# Altium project 自平衡小车主控板.PrjPcb
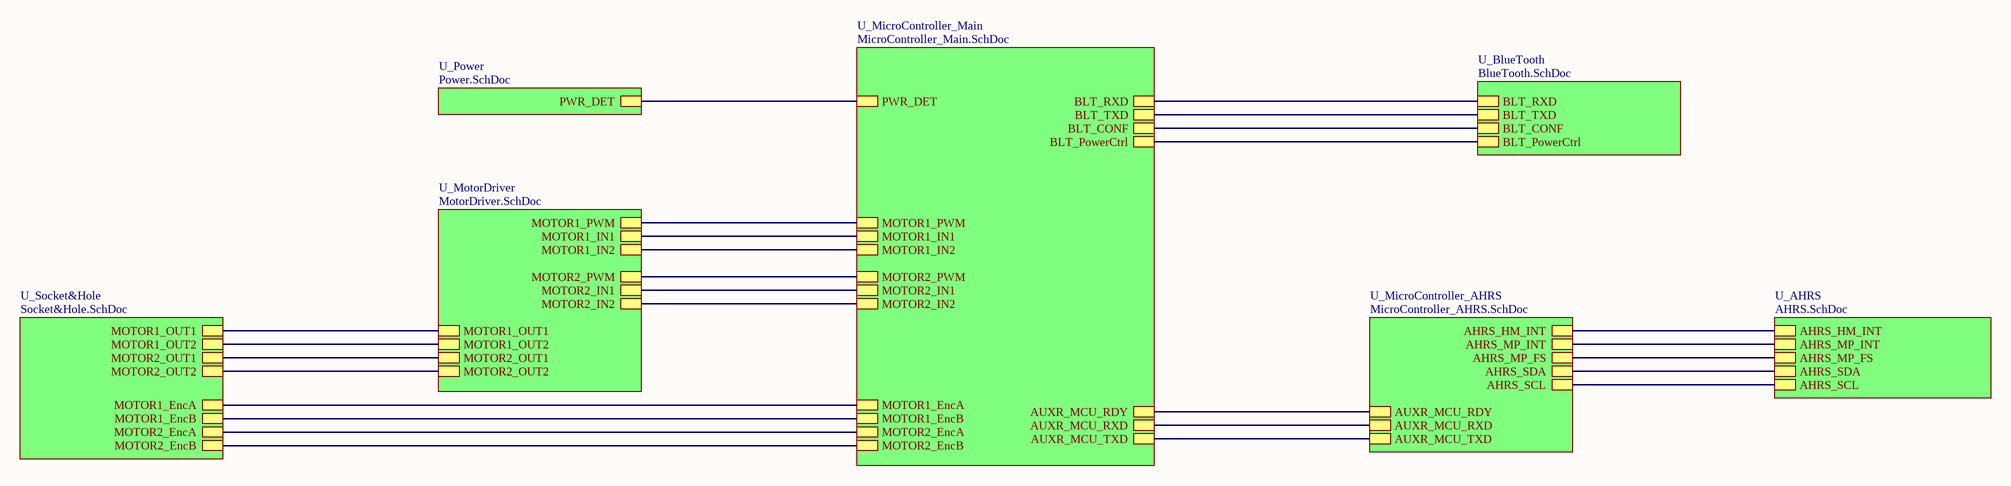
[diagram p0: FrameWork.SchDoc]
8 sheets, 113 parts. Net scope: hierarchical (ports join the sheet entries above them; power ports are global).
Board file: 自平衡小车主控板.PcbDoc
Sheets:
  FrameWork.SchDoc
    U_MicroController_Main = MicroController_Main.SchDoc
    U_Socket&Hole = Socket&Hole.SchDoc
    U_MotorDriver = MotorDriver.SchDoc
    U_MicroController_AHRS = MicroController_AHRS.SchDoc
    U_AHRS = AHRS.SchDoc
    U_Power = Power.SchDoc
    U_BlueTooth = BlueTooth.SchDoc

## Sheet FrameWork.SchDoc: FrameWork.SchDoc
size A3; Author: flotox@yeah.net; Revision: v1.0.0; SheetNumber: 1; SheetTotal: 10

### Sub-sheets
U_AHRS = AHRS.SchDoc: AHRS_MP_INT, AHRS_SCL, AHRS_SDA, AHRS_MP_FS, AHRS_HM_INT
U_BlueTooth = BlueTooth.SchDoc: BLT_RXD, BLT_TXD, BLT_CONF, BLT_PowerCtrl
U_MicroController_AHRS = MicroController_AHRS.SchDoc: AUXR_MCU_RDY, AUXR_MCU_TXD, AUXR_MCU_RXD, AHRS_SCL, AHRS_SDA, AHRS_HM_INT, AHRS_MP_INT, AHRS_MP_FS
U_MicroController_Main = MicroController_Main.SchDoc: BLT_RXD, BLT_TXD, BLT_CONF, BLT_PowerCtrl, AUXR_MCU_TXD, AUXR_MCU_RXD, AUXR_MCU_RDY, PWR_DET, MOTOR1_PWM, MOTOR1_IN2, MOTOR1_IN1, MOTOR2_IN1, MOTOR2_IN2, MOTOR2_PWM, MOTOR1_EncA, MOTOR1_EncB, MOTOR2_EncA, MOTOR2_EncB
U_MotorDriver = MotorDriver.SchDoc: MOTOR1_OUT1, MOTOR1_OUT2, MOTOR2_OUT1, MOTOR2_OUT2, MOTOR1_PWM, MOTOR2_PWM, MOTOR1_IN1, MOTOR1_IN2, MOTOR2_IN1, MOTOR2_IN2
U_Power = Power.SchDoc: PWR_DET
U_Socket&Hole = Socket&Hole.SchDoc: MOTOR1_EncA, MOTOR1_EncB, MOTOR2_EncA, MOTOR2_EncB, MOTOR1_OUT1, MOTOR1_OUT2, MOTOR2_OUT1, MOTOR2_OUT2

### Nets
Adc12_In5: sheet U_MicroController_Main/PWR_DET, sheet U_Power/PWR_DET
I2C1_Scl': sheet U_MicroController_AHRS/AHRS_SCL, sheet U_AHRS/AHRS_SCL
I2C1_Sda': sheet U_MicroController_AHRS/AHRS_SDA, sheet U_AHRS/AHRS_SDA
Tim1Ch1: sheet U_MicroController_Main/MOTOR1_IN1, sheet U_MotorDriver/MOTOR1_IN1
Tim1Ch1N: sheet U_MicroController_Main/MOTOR1_IN2, sheet U_MotorDriver/MOTOR1_IN2
Tim1Ch2: sheet U_MicroController_Main/MOTOR1_PWM, sheet U_MotorDriver/MOTOR1_PWM
Tim2Ch1: sheet U_MicroController_Main/MOTOR2_EncA, sheet U_Socket&Hole/MOTOR2_EncA
Tim2Ch2: sheet U_MicroController_Main/MOTOR2_EncB, sheet U_Socket&Hole/MOTOR2_EncB
Tim3Ch1: sheet U_MicroController_Main/MOTOR1_EncA, sheet U_Socket&Hole/MOTOR1_EncA
Tim3Ch2: sheet U_MicroController_Main/MOTOR1_EncB, sheet U_Socket&Hole/MOTOR1_EncB
Tim8Ch1: sheet U_MicroController_Main/MOTOR2_IN1, sheet U_MotorDriver/MOTOR2_IN1
Tim8Ch1N: sheet U_MicroController_Main/MOTOR2_IN2, sheet U_MotorDriver/MOTOR2_IN2
Tim8Ch2: sheet U_MicroController_Main/MOTOR2_PWM, sheet U_MotorDriver/MOTOR2_PWM
Usart2_Rx: sheet U_MicroController_Main/AUXR_MCU_RXD, sheet U_MicroController_AHRS/AUXR_MCU_RXD
Usart2_Rx': sheet U_MicroController_Main/AUXR_MCU_TXD, sheet U_MicroController_AHRS/AUXR_MCU_TXD
Usart5_Rx: sheet U_MicroController_Main/BLT_RXD, sheet U_BlueTooth/BLT_RXD
Usart5_Tx: sheet U_MicroController_Main/BLT_TXD, sheet U_BlueTooth/BLT_TXD
NetJP7_5: sheet U_Socket&Hole/MOTOR1_OUT1, sheet U_MotorDriver/MOTOR1_OUT1
NetJP7_6: sheet U_Socket&Hole/MOTOR1_OUT2, sheet U_MotorDriver/MOTOR1_OUT2
NetJP8_5: sheet U_Socket&Hole/MOTOR2_OUT1, sheet U_MotorDriver/MOTOR2_OUT1
NetJP8_6: sheet U_Socket&Hole/MOTOR2_OUT2, sheet U_MotorDriver/MOTOR2_OUT2
NetR3_1: sheet U_MicroController_Main/BLT_CONF, sheet U_BlueTooth/BLT_CONF
NetR6_2: sheet U_MicroController_Main/BLT_PowerCtrl, sheet U_BlueTooth/BLT_PowerCtrl
NetU1_15: sheet U_MicroController_AHRS/AHRS_HM_INT, sheet U_AHRS/AHRS_HM_INT
NetU2_11: sheet U_MicroController_AHRS/AHRS_MP_FS, sheet U_AHRS/AHRS_MP_FS
NetU2_12: sheet U_MicroController_AHRS/AHRS_MP_INT, sheet U_AHRS/AHRS_MP_INT
NetU4_11: sheet U_MicroController_Main/AUXR_MCU_RDY, sheet U_MicroController_AHRS/AUXR_MCU_RDY

### Notes on the sheet
- Title
- Revision:
- Number:
- Author:
- Check By:
- Sheet
- of
- Size:
- A3
- Date:

## Sheet MicroController_Main.SchDoc: MicroController_Main.SchDoc
size A4; Author: flotox@yeah.net; Revision: v1.0.0; SheetNumber: 7; SheetTotal: 10
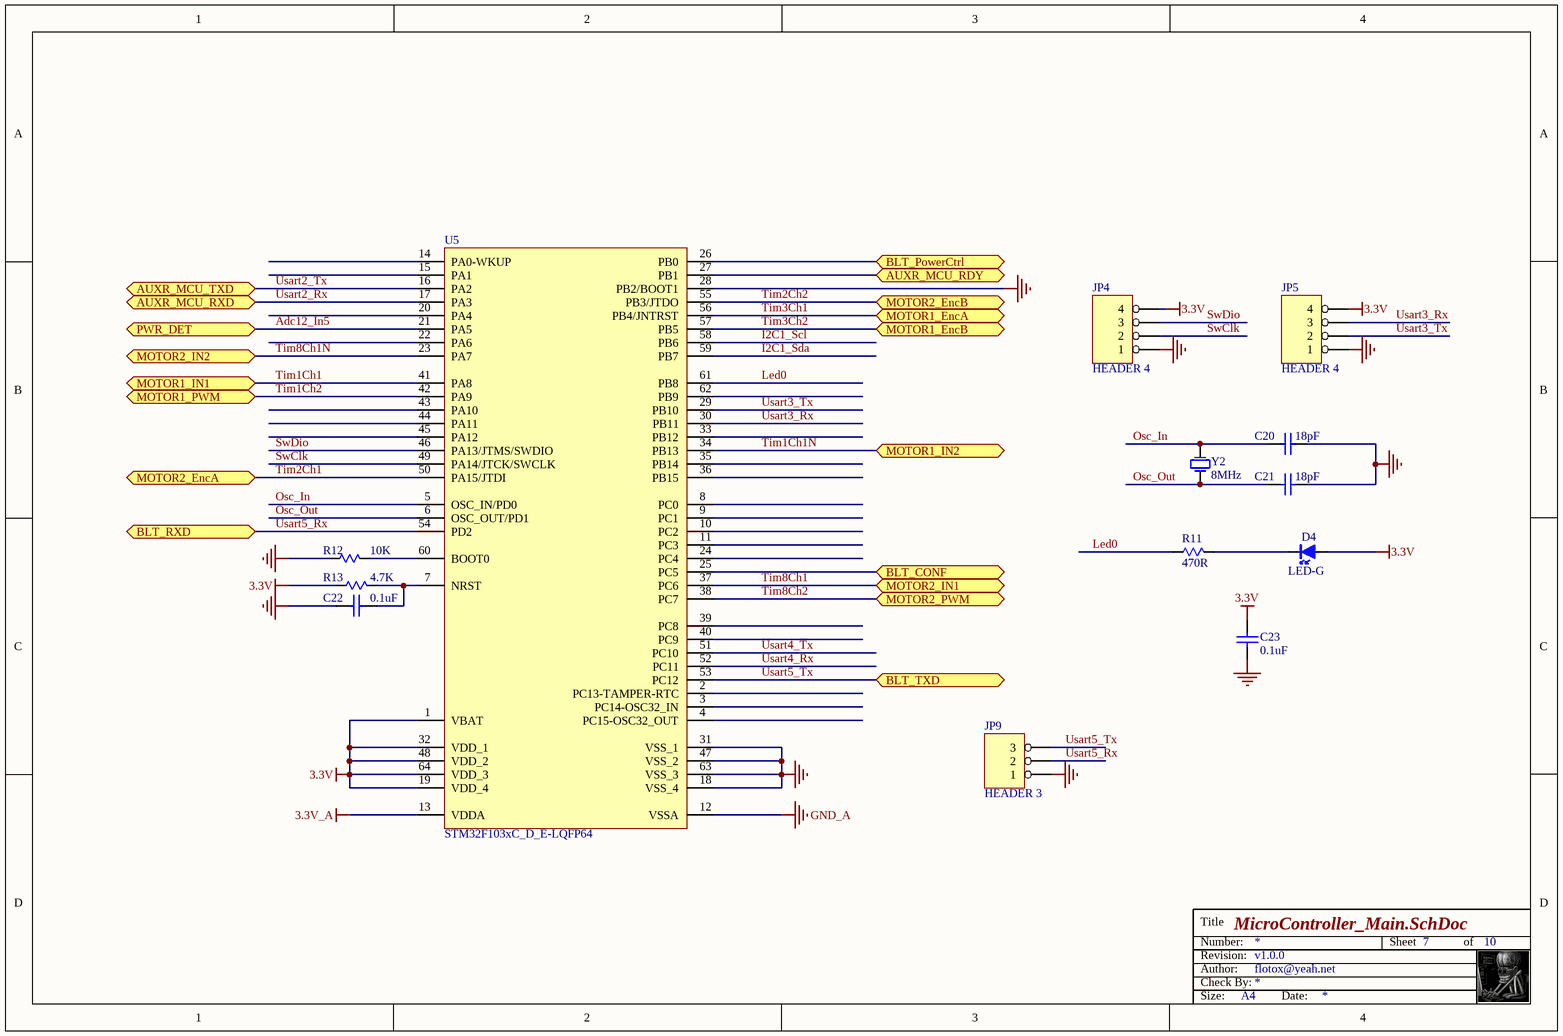
[diagram p1: MicroController_Main.SchDoc]

### Parts
C20  18pF  [C0603-S]
C21  18pF  [C0603-S]
C22  0.1uF  [C0603-S]
C23  0.1uF  [C0603-S]
D4  LED-G  [LED0603]
JP4  HEADER 4  [HDR1X4]
JP5  HEADER 4  [SPOX-4P]
JP9  HEADER 3  [HDR1X3]
R11  470R  [R0603-S]
R12  10K  [R0603-S]
R13  4.7K  [R0603-S]
U5  STM32F103xC_D_E-LQFP64  [LQFP10X10-64]
Y2  8MHz  [XTAL-49SMD]

### Ports
AUXR_MCU_RDY, AUXR_MCU_RXD, AUXR_MCU_TXD, BLT_CONF, BLT_PowerCtrl, BLT_RXD, BLT_TXD, MOTOR1_EncA, MOTOR1_EncB, MOTOR1_IN1, MOTOR1_IN2, MOTOR1_PWM, MOTOR2_EncA, MOTOR2_EncB, MOTOR2_IN1, MOTOR2_IN2, MOTOR2_PWM, PWR_DET

### Nets
3.3V: C23.2 D4.1(A) JP4.4 JP5.4 R13.2 U5.1(VBAT) U5.19(VDD_4) U5.32(VDD_1) U5.48(VDD_2) U5.64(VDD_3)
3.3V_A: U5.13(VDDA)
GND: C20.1 C21.1 C22.2 C23.1 JP4.1 JP5.1 JP9.1 R12.2 U5.18(VSS_4) U5.28(PB2/BOOT1) U5.31(VSS_1) U5.47(VSS_2) U5.63(VSS_3)
GND_A: U5.12(VSSA)
Adc12_In5: U5.21(PA5) ; port PWR_DET
I2C1_Scl: U5.58(PB6)
I2C1_Sda: U5.59(PB7)
Led0: R11.2 U5.61(PB8)
Osc_In: C20.2 U5.5(OSC_IN/PD0) Y2.1(OSC1)
Osc_Out: C21.2 U5.6(OSC_OUT/PD1) Y2.2(OSC2)
SwClk: JP4.2 U5.49(PA14/JTCK/SWCLK)
SwDio: JP4.3 U5.46(PA13/JTMS/SWDIO)
Tim1Ch1: U5.41(PA8) ; port MOTOR1_IN1
Tim1Ch1N: U5.34(PB13) ; port MOTOR1_IN2
Tim1Ch2: U5.42(PA9) ; port MOTOR1_PWM
Tim2Ch1: U5.50(PA15/JTDI) ; port MOTOR2_EncA
Tim2Ch2: U5.55(PB3/JTDO) ; port MOTOR2_EncB
Tim3Ch1: U5.56(PB4/JNTRST) ; port MOTOR1_EncA
Tim3Ch2: U5.57(PB5) ; port MOTOR1_EncB
Tim8Ch1: U5.37(PC6) ; port MOTOR2_IN1
Tim8Ch1N: U5.23(PA7) ; port MOTOR2_IN2
Tim8Ch2: U5.38(PC7) ; port MOTOR2_PWM
Usart2_Rx: U5.17(PA3) ; port AUXR_MCU_RXD
Usart2_Tx: U5.16(PA2) ; port AUXR_MCU_TXD  [project net Usart2_Rx']
Usart3_Rx: JP5.3 U5.30(PB11)
Usart3_Tx: JP5.2 U5.29(PB10)
Usart4_Rx: U5.52(PC11)
Usart4_Tx: U5.51(PC10)
Usart5_Rx: JP9.2 U5.54(PD2) ; port BLT_RXD
Usart5_Tx: JP9.3 U5.53(PC12) ; port BLT_TXD
NetC22_1: C22.1 R13.1 U5.7(NRST)
NetD4_2: D4.2(K) R11.1
NetR3_1: U5.25(PC5) ; port BLT_CONF
NetR6_2: U5.26(PB0) ; port BLT_PowerCtrl
NetR12_1: R12.1 U5.60(BOOT0)
NetU4_11: U5.27(PB1) ; port AUXR_MCU_RDY

Not connected (* = marked no-connect by the designer): U5 2(PC13-TAMPER-RTC) 3(PC14-OSC32_IN) 4(PC15-OSC32_OUT) 8(PC0) 9(PC1) 10(PC2) 11(PC3) 14(PA0-WKUP) 15(PA1) 20(PA4) 22(PA6) 24(PC4) 33(PB12) 35(PB14) 36(PB15) 39(PC8) 40(PC9) 43(PA10) 44(PA11) 45(PA12) 62(PB9)

### Notes on the sheet
- Title
- Revision:
- Number:
- Author:
- Check By:
- Sheet
- of
- Size:
- A4
- Date:

### Library data of the parts
C20-C23 = CAP: Capacitor
D4 = LED: Light Emitting Diode
R11-R13 = RES: Resistor
U5 = STM32F103xC_D_E-LQFP64: High-density performance line ARM-based 32-bit MCU with 256 to 512KB Flash, USB, CAN, 11 timers, 3 ADCs, 13 communication interfaces
Y2 = XTAL-CRYSTALS: Crystals

## Sheet Socket&Hole.SchDoc: Socket&Hole.SchDoc
size A4; CheckedBy: fx; Author: flotox@yeah.net; Revision: v1.0.0; SheetNumber: 10; SheetTotal: 10
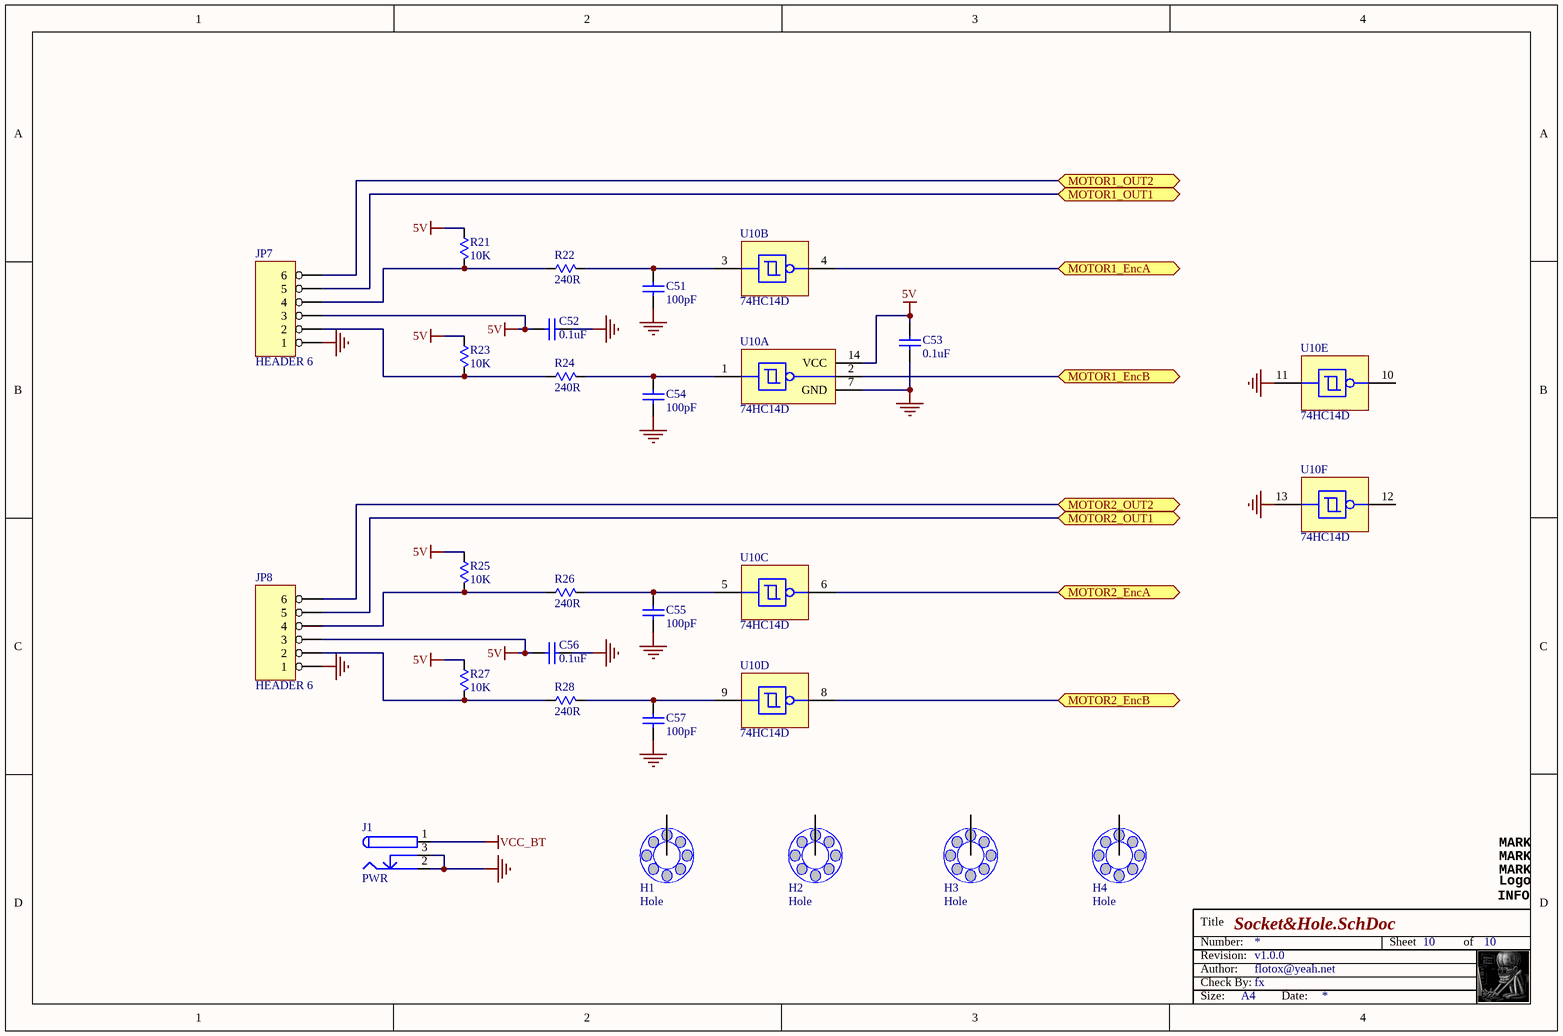
[diagram p2: Socket&Hole.SchDoc]

### Parts
C51  100pF  [C0603-S]
C52  0.1uF  [C0603-S]
C53  0.1uF  [C0603-S]
C54  100pF  [C0603-S]
C55  100pF  [C0603-S]
C56  0.1uF  [C0603-S]
C57  100pF  [C0603-S]
H1  Hole  [HT-M3-S]
H2  Hole  [HT-M3-S]
H3  Hole  [HT-M3-S]
H4  Hole  [HT-M3-S]
INFO1  INFO  [FX_DESIGN_INFO]  (value not drawn)
J1  PWR  [POWER-A]
JP7  HEADER 6  [WHDR2.0X6]
JP8  HEADER 6  [WHDR2.0X6]
LG1  LOGO  [Hat_Logo]  (value not drawn)
MARK1  MARK  [MARK-S]  (value not drawn)
MARK2  MARK  [MARK-S]  (value not drawn)
MARK3  MARK  [MARK-S]  (value not drawn)
R21  10K  [R0603-S]
R22  240R  [R0603-S]
R23  10K  [R0603-S]
R24  240R  [R0603-S]
R25  10K  [R0603-S]
R26  240R  [R0603-S]
R27  10K  [R0603-S]
R28  240R  [R0603-S]
U10  74HC14D  [SO14-150]  (parts A,B,C,D,E,F of 6)

### Ports
MOTOR1_EncA, MOTOR1_EncB, MOTOR1_OUT1, MOTOR1_OUT2, MOTOR2_EncA, MOTOR2_EncB, MOTOR2_OUT1, MOTOR2_OUT2

### Nets
5V: C52.1 C53.1 C56.1 JP7.3 JP8.3 R21.2 R23.2 R25.2 R27.2 U10.14(VCC)
GND: C51.1 C52.2 C53.2 C54.1 C55.1 C56.2 C57.1 J1.2 J1.3 JP7.1 JP8.1 U10.7(GND) U10.11(A) U10.13(A)
VCC_BT: J1.1
Tim2Ch1: U10.6(Y) ; port MOTOR2_EncA
Tim2Ch2: U10.8(Y) ; port MOTOR2_EncB
Tim3Ch1: U10.4(Y) ; port MOTOR1_EncA
Tim3Ch2: U10.2(Y) ; port MOTOR1_EncB
NetC51_2: C51.2 R22.1 U10.3(A)
NetC54_2: C54.2 R24.1 U10.1(A)
NetC55_2: C55.2 R26.1 U10.5(A)
NetC57_2: C57.2 R28.1 U10.9(A)
NetJP7_2: JP7.2 R23.1 R24.2
NetJP7_4: JP7.4 R21.1 R22.2
NetJP7_5: JP7.5 ; port MOTOR1_OUT1
NetJP7_6: JP7.6 ; port MOTOR1_OUT2
NetJP8_2: JP8.2 R27.1 R28.2
NetJP8_4: JP8.4 R25.1 R26.2
NetJP8_5: JP8.5 ; port MOTOR2_OUT1
NetJP8_6: JP8.6 ; port MOTOR2_OUT2

Not connected (* = marked no-connect by the designer): H1 1; H2 1; H3 1; H4 1; U10 10(Y) 12(Y)

### Notes on the sheet
- Title
- Revision:
- Number:
- Author:
- Check By:
- Sheet
- of
- Size:
- A4
- Date:
- (in symbol LOGO) Logo

### Library data of the parts
C51-C57 = CAP: Capacitor
H1-H4 = Hole: Mounting holes
R21-R28 = RES: Resistor
U10 = 74HC14D: Hex inverting Schmitt trigger

## Sheet MotorDriver.SchDoc: MotorDriver.SchDoc
size A4; CheckedBy: fx; Author: flotox@yeah.net; Revision: v1.0.0; SheetNumber: 9; SheetTotal: 10
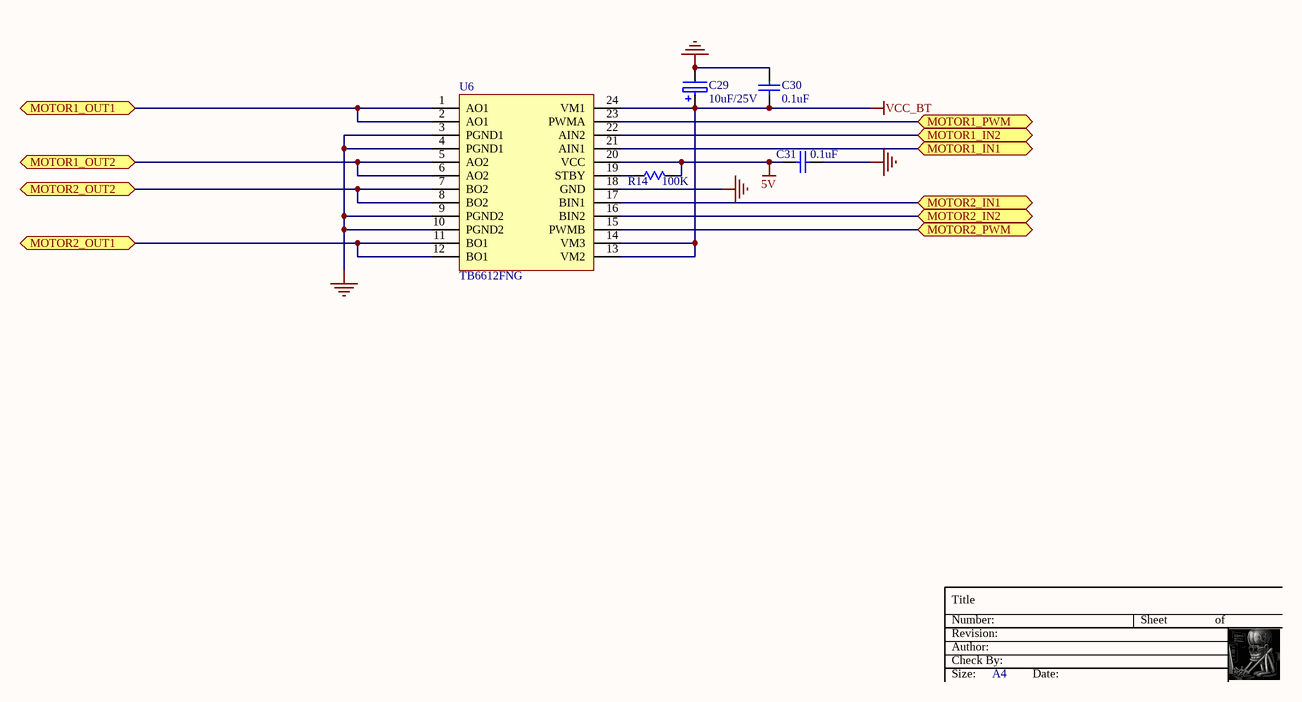
[diagram p3: MotorDriver.SchDoc]

### Parts
C29  10uF/25V  [TC3528-1411]
C30  0.1uF  [C0603-S]
C31  0.1uF  [C0603-S]
R14  100K  [R0603-S]
U6  TB6612FNG  [SSOP24-300-0.65A]

### Ports
MOTOR1_IN1, MOTOR1_IN2, MOTOR1_OUT1, MOTOR1_OUT2, MOTOR1_PWM, MOTOR2_IN1, MOTOR2_IN2, MOTOR2_OUT1, MOTOR2_OUT2, MOTOR2_PWM

### Nets
5V: C31.2 R14.1 U6.20(VCC)
GND: C29.2 C30.2 C31.1 U6.3(PGND1) U6.4(PGND1) U6.9(PGND2) U6.10(PGND2) U6.18(GND)
VCC_BT: C29.1 C30.1 U6.13(VM2) U6.14(VM3) U6.24(VM1)
Tim1Ch1: U6.21(AIN1) ; port MOTOR1_IN1
Tim1Ch1N: U6.22(AIN2) ; port MOTOR1_IN2
Tim1Ch2: U6.23(PWMA) ; port MOTOR1_PWM
Tim8Ch1: U6.17(BIN1) ; port MOTOR2_IN1
Tim8Ch1N: U6.16(BIN2) ; port MOTOR2_IN2
Tim8Ch2: U6.15(PWMB) ; port MOTOR2_PWM
NetJP7_5: U6.1(AO1) U6.2(AO1) ; port MOTOR1_OUT1
NetJP7_6: U6.5(AO2) U6.6(AO2) ; port MOTOR1_OUT2
NetJP8_5: U6.11(BO1) U6.12(BO1) ; port MOTOR2_OUT1
NetJP8_6: U6.7(BO2) U6.8(BO2) ; port MOTOR2_OUT2
NetR14_2: R14.2 U6.19(STBY)

### Notes on the sheet
- Title
- Revision:
- Number:
- Author:
- Check By:
- Sheet
- of
- Size:
- A4
- Date:

### Library data of the parts
C29 = CAP-ELEC: Polarized Capacitor
C30 C31 = CAP: Capacitor
R14 = RES: Resistor
U6 = TB6612FNG: Driver IC for Dual DC motor

## Sheet MicroController_AHRS.SchDoc: MicroController_AHRS.SchDoc
size A4; CheckedBy: fx; Author: flotox@yeah.net; Revision: v1.0.0; SheetNumber: 8; SheetTotal: 10
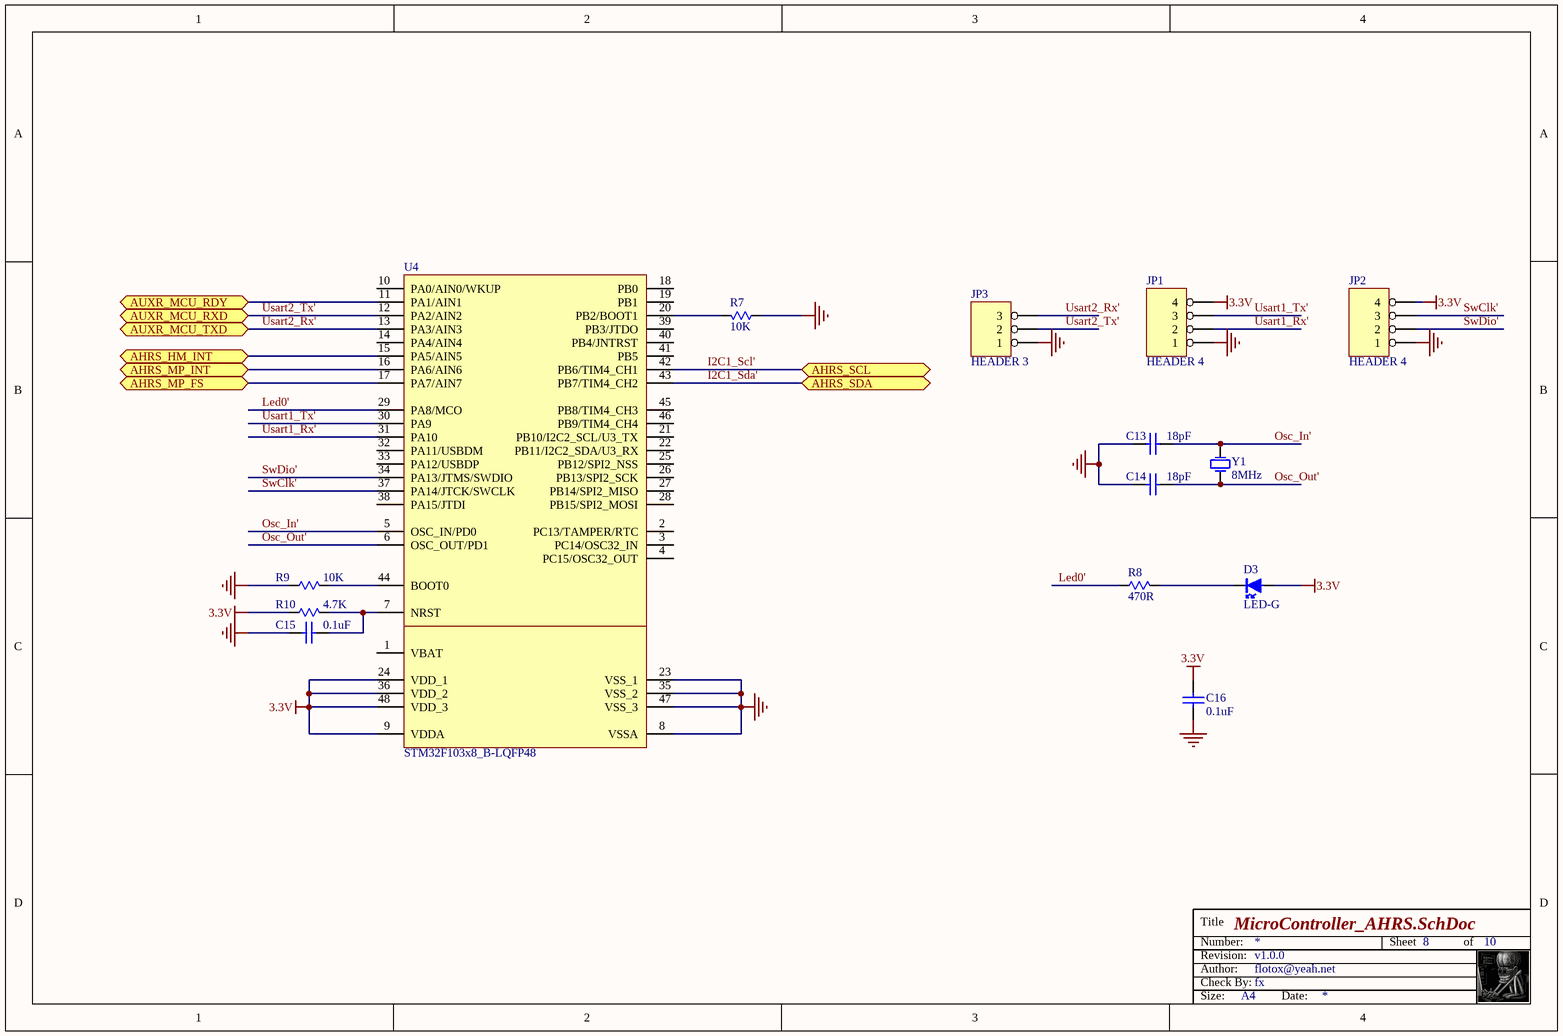
[diagram p4: MicroController_AHRS.SchDoc]

### Parts
C13  18pF  [C0603-S]
C14  18pF  [C0603-S]
C15  0.1uF  [C0603-S]
C16  0.1uF  [C0603-S]
D3  LED-G  [LED0603]
JP1  HEADER 4  [SPOX-4P]
JP2  HEADER 4  [HDR1X4]
JP3  HEADER 3  [HDR1X3]
R7  10K  [R0603-S]
R8  470R  [R0603-S]
R9  10K  [R0603-S]
R10  4.7K  [R0603-S]
U4  STM32F103x8_B-LQFP48  [LQFP7x7-48]
Y1  8MHz  [XTAL-49SMD]

### Ports
AHRS_HM_INT, AHRS_MP_FS, AHRS_MP_INT, AHRS_SCL, AHRS_SDA, AUXR_MCU_RDY, AUXR_MCU_RXD, AUXR_MCU_TXD

### Nets
3.3V: C16.2 D3.1(A) JP1.4 JP2.4 R10.2 U4.9(VDDA) U4.24(VDD_1) U4.36(VDD_2) U4.48(VDD_3)
GND: C13.2 C14.2 C15.2 C16.1 JP1.1 JP2.1 JP3.1 R7.2 R9.2 U4.8(VSSA) U4.23(VSS_1) U4.35(VSS_2) U4.47(VSS_3)
I2C1_Scl': U4.42(PB6/TIM4_CH1) ; port AHRS_SCL
I2C1_Sda': U4.43(PB7/TIM4_CH2) ; port AHRS_SDA
Led0': R8.2 U4.29(PA8/MCO)
Osc_In': C13.1 U4.5(OSC_IN/PD0) Y1.1(OSC1)
Osc_Out': C14.1 U4.6(OSC_OUT/PD1) Y1.2(OSC2)
SwClk': JP2.3 U4.37(PA14/JTCK/SWCLK)
SwDio': JP2.2 U4.34(PA13/JTMS/SWDIO)
Usart1_Rx': JP1.2 U4.31(PA10)
Usart1_Tx': JP1.3 U4.30(PA9)
Usart2_Rx': JP3.3 U4.13(PA3/AIN3) ; port AUXR_MCU_TXD
Usart2_Tx': JP3.2 U4.12(PA2/AIN2) ; port AUXR_MCU_RXD  [project net Usart2_Rx]
NetC15_1: C15.1 R10.1 U4.7(NRST)
NetD3_2: D3.2(K) R8.1
NetR7_1: R7.1 U4.20(PB2/BOOT1)
NetR9_1: R9.1 U4.44(BOOT0)
NetU1_15: U4.15(PA5/AIN5) ; port AHRS_HM_INT
NetU2_11: U4.17(PA7/AIN7) ; port AHRS_MP_FS
NetU2_12: U4.16(PA6/AIN6) ; port AHRS_MP_INT
NetU4_11: U4.11(PA1/AIN1) ; port AUXR_MCU_RDY

Not connected (* = marked no-connect by the designer): U4 1(VBAT) 2(PC13/TAMPER/RTC) 3(PC14/OSC32_IN) 4(PC15/OSC32_OUT) 10(PA0/AIN0/WKUP) 14(PA4/AIN4) 18(PB0) 19(PB1) 21(PB10/I2C2_SCL/U3_TX) 22(PB11/I2C2_SDA/U3_RX) 25(PB12/SPI2_NSS) 26(PB13/SPI2_SCK) 27(PB14/SPI2_MISO) 28(PB15/SPI2_MOSI) 32(PA11/USBDM) 33(PA12/USBDP) 38(PA15/JTDI) 39(PB3/JTDO) 40(PB4/JNTRST) 41(PB5) 45(PB8/TIM4_CH3) 46(PB9/TIM4_CH4)

### Notes on the sheet
- Title
- Revision:
- Number:
- Author:
- Check By:
- Sheet
- of
- Size:
- A4
- Date:

### Library data of the parts
C13-C16 = CAP: Capacitor
D3 = LED: Light Emitting Diode
R7-R10 = RES: Resistor
U4 = STM32F103x8_B-LQFP48: Medium-density performance line ARM-based 32-bit MCU with 64 or 128 KB Flash, USB, CAN, 7 timers, 2 ADCs, 9 communication interfaces
Y1 = XTAL-CRYSTALS: Crystals

## Sheet AHRS.SchDoc: AHRS.SchDoc
size A4; CheckedBy: fx; Author: flotox@yeah.net; Revision: v1.0.0; SheetNumber: 6; SheetTotal: 10
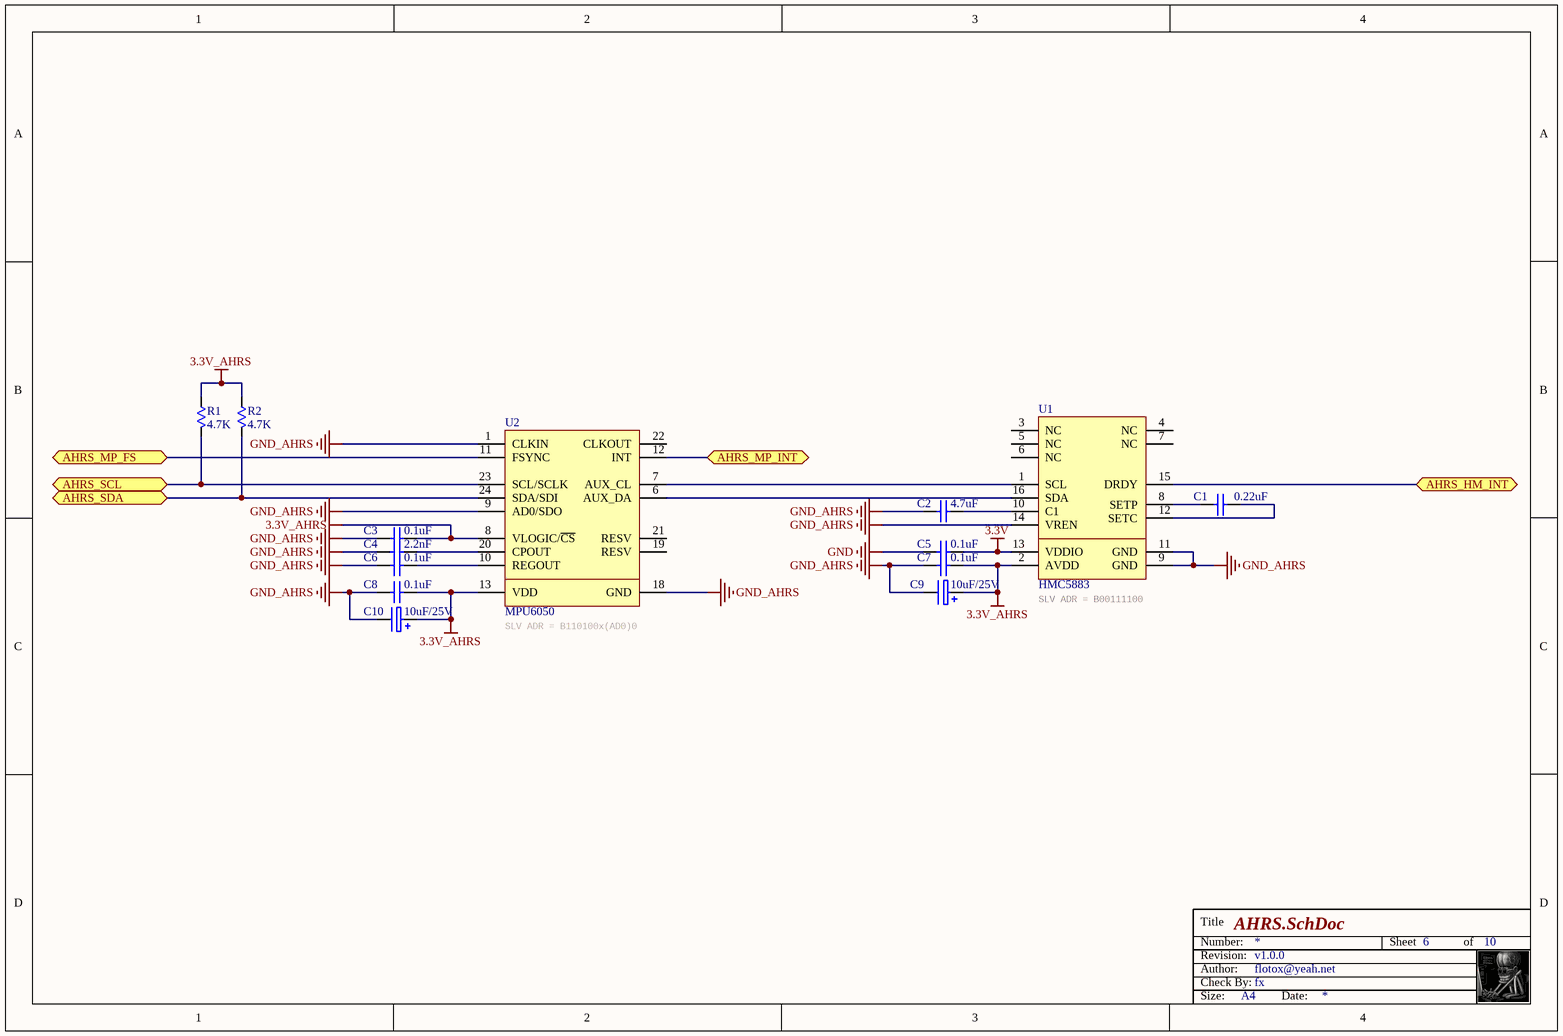
[diagram p5: AHRS.SchDoc]

### Parts
C1  0.22uF  [C0603-S]
C2  4.7uF  [C0603-S]
C3  0.1uF  [C0603-S]
C4  2.2nF  [C0603-S]
C5  0.1uF  [C0603-S]
C6  0.1uF  [C0603-S]
C7  0.1uF  [C0603-S]
C8  0.1uF  [C0603-S]
C9  10uF/25V  [TC3528-1411]
C10  10uF/25V  [TC3528-1411]
R1  4.7K  [R0603-S]
R2  4.7K  [R0603-S]
U1  HMC5883  [QFN50P300X300-16]
U2  MPU6050  [QFN50P400X400-24]

### Ports
AHRS_HM_INT, AHRS_MP_FS, AHRS_MP_INT, AHRS_SCL, AHRS_SDA

### Nets
3.3V: C5.1 U1.13(VDDIO)
3.3V_AHRS: C3.1 C7.1 C8.2 C9.1 C10.1 R1.2 R2.2 U1.2(AVDD) U2.8(VLOGIC/~{CS}) U2.13(VDD)
GND: C5.2
GND_AHRS: C2.2 C3.2 C4.2 C6.1 C7.2 C8.1 C9.2 C10.2 U1.9(GND) U1.11(GND) U1.14(VREN) U2.1(CLKIN) U2.9(AD0/SDO) U2.18(GND)
I2C1_Scl': R1.1 U2.23(SCL/SCLK) ; port AHRS_SCL
I2C1_Sda': R2.1 U2.24(SDA/SDI) ; port AHRS_SDA
NetC1_1: C1.1 U1.12(SETC)
NetC1_2: C1.2 U1.8(SETP)
NetC2_1: C2.1 U1.10(C1)
NetC4_1: C4.1 U2.20(CPOUT)
NetC6_2: C6.2 U2.10(REGOUT)
NetU1_1: U1.1(SCL) U2.7(AUX_CL)
NetU1_15: U1.15(DRDY) ; port AHRS_HM_INT
NetU1_16: U1.16(SDA) U2.6(AUX_DA)
NetU2_11: U2.11(FSYNC) ; port AHRS_MP_FS
NetU2_12: U2.12(INT) ; port AHRS_MP_INT

Not connected (* = marked no-connect by the designer): U1 3(NC) 4(NC) 5(NC) 6(NC) 7(NC); U2 19(RESV) 21(RESV) 22(CLKOUT)

### Notes on the sheet
- (near U2) SLV ADR = B110100x(AD0)0
- (near U1) SLV ADR = B00111100
- Title
- Revision:
- Number:
- Author:
- Check By:
- Sheet
- of
- Size:
- A4
- Date:

### Library data of the parts
C1-C8 = CAP: Capacitor
C9 C10 = CAP-ELEC: Polarized Capacitor
R1 R2 = RES: Resistor
U1 = HMC5883L: 3-Axis Digital Compass IC
U2 = MPU60x0: 6-axis  MotionTracking  device

## Sheet Power.SchDoc: Power.SchDoc
size A4; CheckedBy: fx; Author: flotox@yeah.net; Revision: v1.0.0; SheetNumber: 4; SheetTotal: 10
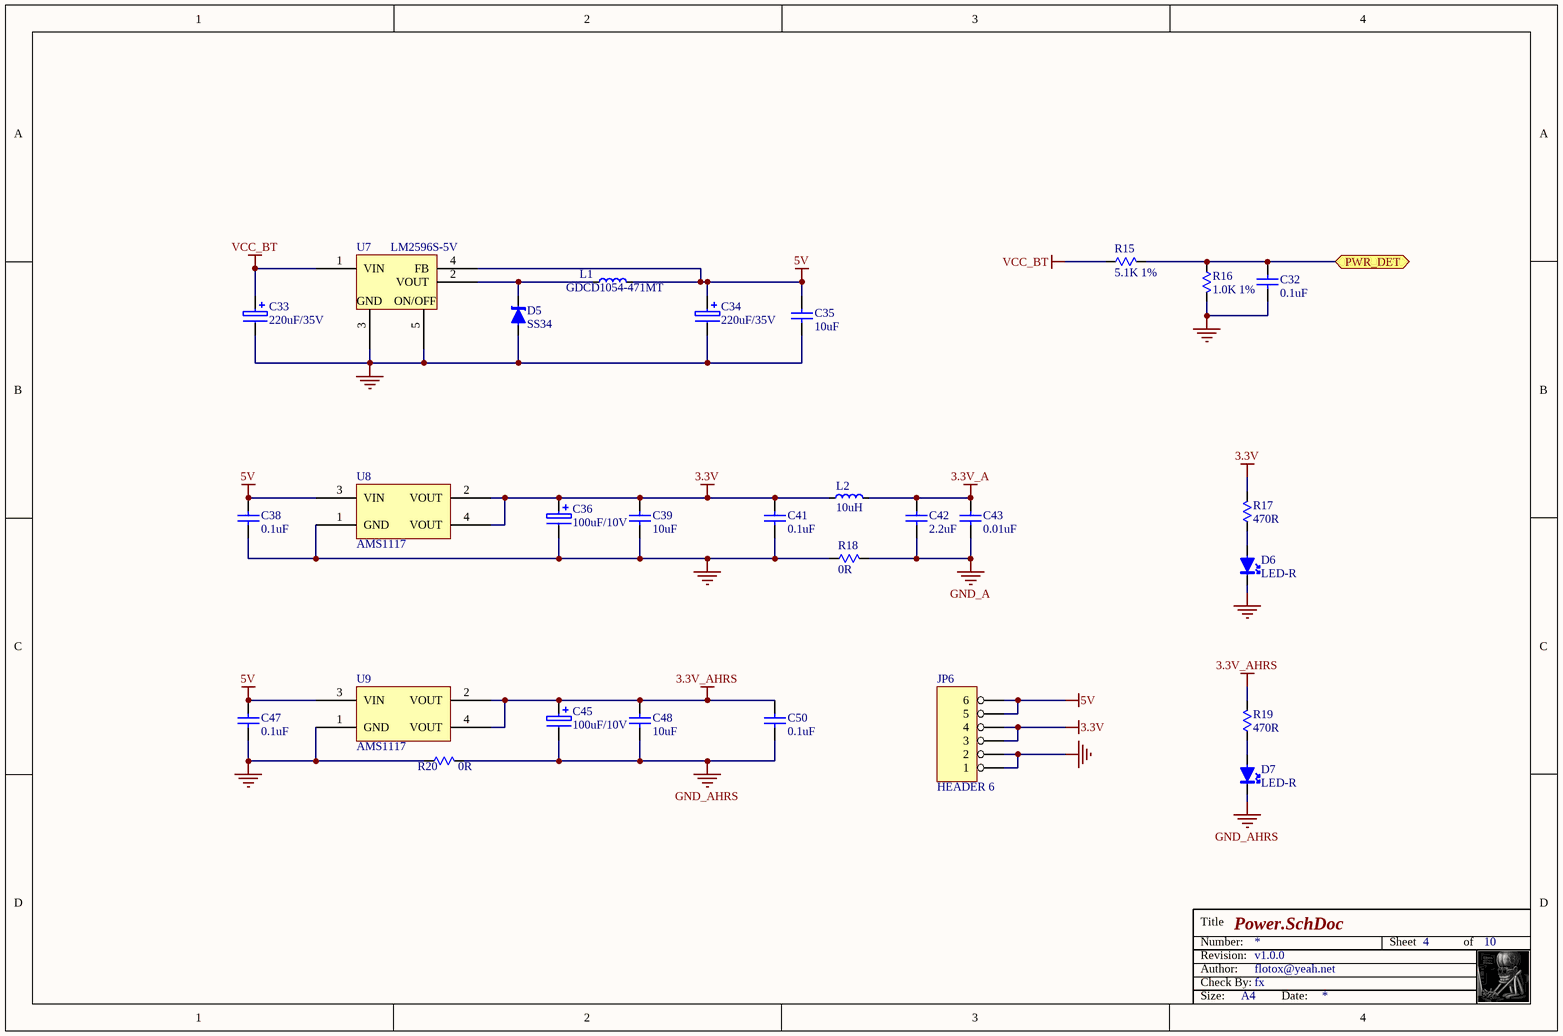
[diagram p6: Power.SchDoc]

### Parts
C32  0.1uF  [C0603-S]
C33  220uF/35V  [CAPPR-8.3X8.3-SM-F]
C34  220uF/35V  [CAPPR-8.3X8.3-SM-F]
C35  10uF  [C0603-S]
C36  100uF/10V  [CAPPR-5.3X5.3-SM-C]
C38  0.1uF  [C0603-S]
C39  10uF  [C0603-S]
C41  0.1uF  [C0603-S]
C42  2.2uF  [C0603-S]
C43  0.01uF  [C0603-S]
C45  100uF/10V  [CAPPR-5.3X5.3-SM-C]
C47  0.1uF  [C0603-S]
C48  10uF  [C0603-S]
C50  0.1uF  [C0603-S]
D5  SS34  [SMB]
D6  LED-R  [LED0603]
D7  LED-R  [LED0603]
JP6  HEADER 6  [WHDR2.0X6]
L1  GDCD1054-471MT  [GDCD1054]
L2  10uH  [L0603-C]
R15  5.1K 1%  [R0603-S]
R16  1.0K 1%  [R0603-S]
R17  470R  [R0603-S]
R18  0R  [R0805-S]
R19  470R  [R0603-S]
R20  0R  [R0805-S]
U7  LM2596S-5V  [D2PAK]
U8  AMS1117  [SOT-223]
U9  AMS1117  [SOT-223]

### Ports
PWR_DET

### Nets
3.3V: C36.1 C39.2 C41.2 JP6.3 JP6.4 L2.1 R17.1 U8.2(VOUT) U8.4(VOUT)
3.3V_A: C42.2 C43.2 L2.2
3.3V_AHRS: C45.1 C48.2 C50.2 R19.1 U9.2(VOUT) U9.4(VOUT)
5V: C34.1 C35.2 C38.2 C47.2 JP6.5 JP6.6 L1.2 U7.4(FB) U8.3(VIN) U9.3(VIN)
GND: C32.1 C33.2 C34.2 C35.1 C36.2 C38.1 C39.1 C41.1 C47.1 D5.1(A) D6.2(K) JP6.1 JP6.2 R16.1 R18.2 R20.2 U7.3(GND) U7.5(ON/OFF) U8.1(GND) U9.1(GND)
GND_A: C42.1 C43.1 R18.1
GND_AHRS: C45.2 C48.1 C50.1 D7.2(K) R20.1
VCC_BT: C33.1 R15.2 U7.1(VIN)
Adc12_In5: C32.2 R15.1 R16.2 ; port PWR_DET
NetD5_2: D5.2(K) L1.1 U7.2(VOUT)
NetD6_1: D6.1(A) R17.2
NetD7_1: D7.1(A) R19.2

### Notes on the sheet
- Title
- Revision:
- Number:
- Author:
- Check By:
- Sheet
- of
- Size:
- A4
- Date:

### Library data of the parts
C32 C35 C38 C39 C41-C43 C47 C48 C50 = CAP: Capacitor
C33 C34 C36 C45 = CAP-ELEC: Polarized Capacitor
D5 = DIODE-SBD: Schottky barrier rectifier
D6 D7 = LED: Light Emitting Diode
L1 L2 = INDUCT: Inductor
R15-R20 = RES: Resistor
U7 = LM2596
U8 U9 = AMS1117: 800mA Low-Dropout Linear Regulator

## Sheet BlueTooth.SchDoc: BlueTooth.SchDoc
size A4; CheckedBy: fx; Author: flotox@yeah.net; Revision: v1.0.0; SheetNumber: 3; SheetTotal: 10
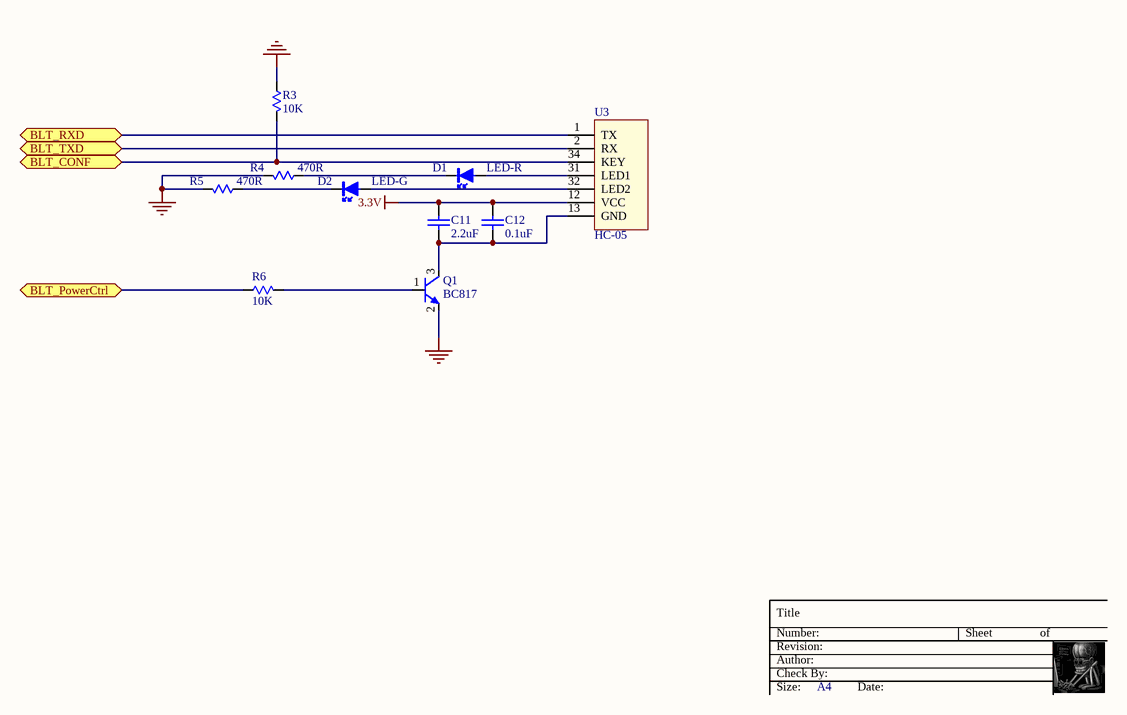
[diagram p7: BlueTooth.SchDoc]

### Parts
C11  2.2uF  [C0603-S]
C12  0.1uF  [C0603-S]
D1  LED-R  [LED0603]
D2  LED-G  [LED0603]
Q1  BC817  [SOT-23]
R3  10K  [R0603-S]
R4  470R  [R0603-S]
R5  470R  [R0603-S]
R6  10K  [R0603-S]
U3  HC-05  [HC-05]

### Ports
BLT_CONF, BLT_PowerCtrl, BLT_RXD, BLT_TXD

### Nets
3.3V: C11.2 C12.2 U3.12(VCC)
GND: Q1.2(E) R3.2 R4.1 R5.1
Usart5_Rx: U3.1(TX) ; port BLT_RXD
Usart5_Tx: U3.2(RX) ; port BLT_TXD
NetC11_1: C11.1 C12.1 Q1.3(C) U3.13(GND)
NetD1_1: D1.1(A) U3.31(LED1)
NetD1_2: D1.2(K) R4.2
NetD2_1: D2.1(A) U3.32(LED2)
NetD2_2: D2.2(K) R5.2
NetQ1_1: Q1.1(B) R6.1
NetR3_1: R3.1 U3.34(KEY) ; port BLT_CONF
NetR6_2: R6.2 ; port BLT_PowerCtrl

### Notes on the sheet
- Title
- Revision:
- Number:
- Author:
- Check By:
- Sheet
- of
- Size:
- A4
- Date:

### Library data of the parts
C11 C12 = CAP: Capacitor
D1 D2 = LED: Light Emitting Diode
Q1 = NPN: NPN General Purpose Amplifier
R3-R6 = RES: Resistor
U3 = HC-05: Bluetooth Module

## Nets that join several sheets
3.3V: MicroController_Main (10 pins), MicroController_AHRS (9 pins), AHRS (C5.1 U1.13), Power (9 pins), BlueTooth (C11.2 C12.2 U3.12)
3.3V_A: MicroController_Main (U5.13), Power (C42.2 C43.2 L2.2)
3.3V_AHRS: AHRS (10 pins), Power (6 pins)
5V: Socket&Hole (10 pins), MotorDriver (C31.2 R14.1 U6.20), Power (10 pins)
GND: MicroController_Main (13 pins), Socket&Hole (14 pins), MotorDriver (8 pins), MicroController_AHRS (13 pins), AHRS (C5.2), Power (20 pins), BlueTooth (Q1.2 R3.2 R4.1 R5.1)
GND_A: MicroController_Main (U5.12), Power (C42.1 C43.1 R18.1)
GND_AHRS: AHRS (14 pins), Power (5 pins)
VCC_BT: Socket&Hole (J1.1), MotorDriver (5 pins), Power (C33.1 R15.2 U7.1)
Adc12_In5: MicroController_Main (U5.21), Power (C32.2 R15.1 R16.2)
I2C1_Scl': MicroController_AHRS (U4.42), AHRS (R1.1 U2.23)
I2C1_Sda': MicroController_AHRS (U4.43), AHRS (R2.1 U2.24)
NetJP7_5: Socket&Hole (JP7.5), MotorDriver (U6.1 U6.2)
NetJP7_6: Socket&Hole (JP7.6), MotorDriver (U6.5 U6.6)
NetJP8_5: Socket&Hole (JP8.5), MotorDriver (U6.11 U6.12)
NetJP8_6: Socket&Hole (JP8.6), MotorDriver (U6.7 U6.8)
NetR3_1: MicroController_Main (U5.25), BlueTooth (R3.1 U3.34)
NetR6_2: MicroController_Main (U5.26), BlueTooth (R6.2)
NetU1_15: MicroController_AHRS (U4.15), AHRS (U1.15)
NetU2_11: MicroController_AHRS (U4.17), AHRS (U2.11)
NetU2_12: MicroController_AHRS (U4.16), AHRS (U2.12)
NetU4_11: MicroController_Main (U5.27), MicroController_AHRS (U4.11)
Tim1Ch1: MicroController_Main (U5.41), MotorDriver (U6.21)
Tim1Ch1N: MicroController_Main (U5.34), MotorDriver (U6.22)
Tim1Ch2: MicroController_Main (U5.42), MotorDriver (U6.23)
Tim2Ch1: MicroController_Main (U5.50), Socket&Hole (U10.6)
Tim2Ch2: MicroController_Main (U5.55), Socket&Hole (U10.8)
Tim3Ch1: MicroController_Main (U5.56), Socket&Hole (U10.4)
Tim3Ch2: MicroController_Main (U5.57), Socket&Hole (U10.2)
Tim8Ch1: MicroController_Main (U5.37), MotorDriver (U6.17)
Tim8Ch1N: MicroController_Main (U5.23), MotorDriver (U6.16)
Tim8Ch2: MicroController_Main (U5.38), MotorDriver (U6.15)
Usart2_Rx: MicroController_Main (U5.17), MicroController_AHRS (JP3.2 U4.12)
Usart2_Rx': MicroController_Main (U5.16), MicroController_AHRS (JP3.3 U4.13)
Usart5_Rx: MicroController_Main (JP9.2 U5.54), BlueTooth (U3.1)
Usart5_Tx: MicroController_Main (JP9.3 U5.53), BlueTooth (U3.2)